# EAGLE schematic DDS Sine Sweeper (EAGLE 6.4)
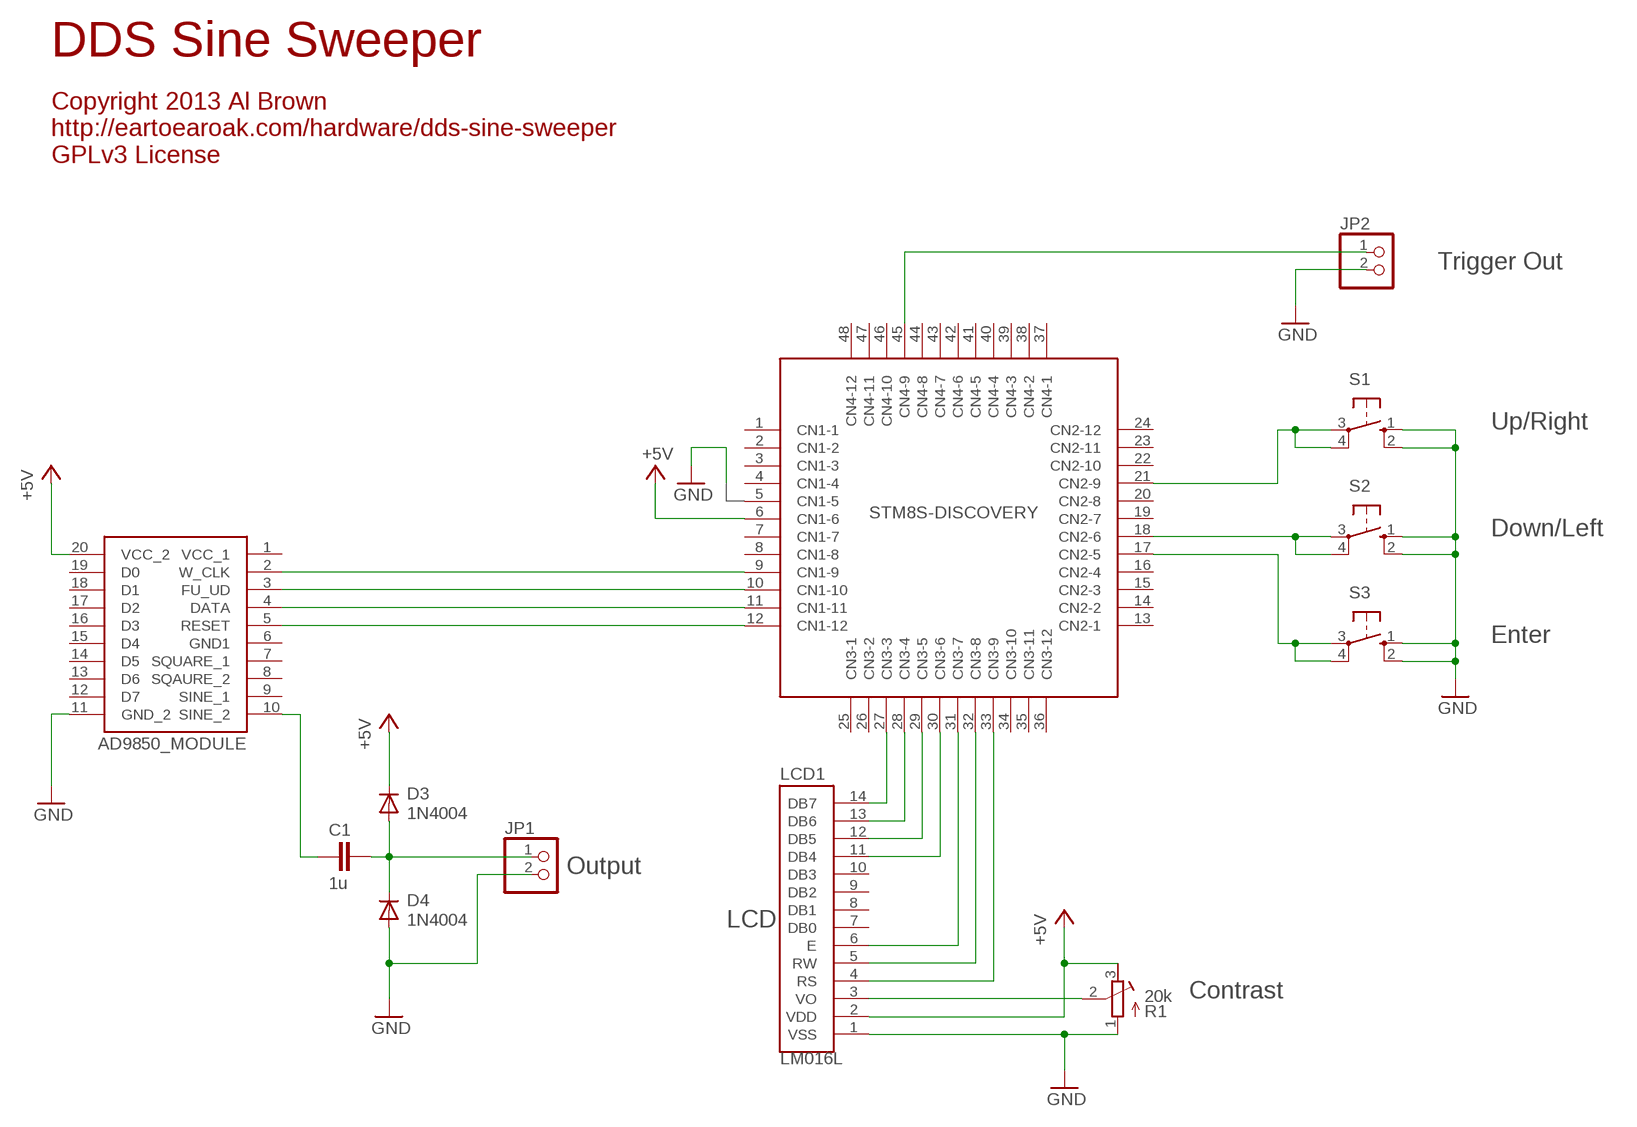
[diagram p0: schematic, sheet 1]

## Parts
BOARD1  STM8S-DISCOVERY  [STM8S-DISCOVERY]
BOARD2  AD9850_MODULE  [10X2]
C1  1u  C-EUC025_050-024X070  [C025_050-024X070]
D3  1N4004  [DO41-10]
D4  1N4004  [DO41-10]
JP1  PINHD-1X2  [1X02]
JP2  PINHD-1X2  [1X02]
LCD1  LM016L  [LM016L]
R1  20k  R-TRIMM3339P  [RTRIM3339P]
S1  10-XX  [B3F-10XX]
S2  10-XX  [B3F-10XX]
S3  10-XX  [B3F-10XX]

## Nets
+5V: BOARD1.6(CN1-6) BOARD2.20(VCC_2) D3.C LCD1.2(VDD) R1.3(A)
GND: BOARD2.11(GND_2) D4.A JP1.2 JP2.2 LCD1.1(VSS) R1.1(E) S1.1(S) S1.2(S1) S2.1(S) S2.2(S1) S3.1(S) S3.2(S1)
N$1: BOARD1.33(CN3-9) LCD1.4(RS)
N$2: BOARD1.32(CN3-8) LCD1.5(RW)
N$3: BOARD1.31(CN3-7) LCD1.6(E)
N$4: BOARD1.30(CN3-6) LCD1.11(DB4)
N$5: BOARD1.29(CN3-5) LCD1.12(DB5)
N$6: BOARD1.28(CN3-4) LCD1.13(DB6)
N$7: BOARD1.27(CN3-3) LCD1.14(DB7)
N$8: LCD1.3(VO) R1.2(S)
N$9: BOARD1.17(CN2-5) S3.3(P) S3.4(P1)
N$10: BOARD1.18(CN2-6) S2.3(P) S2.4(P1)
N$11: BOARD1.21(CN2-9) S1.3(P) S1.4(P1)
N$12: BOARD1.9(CN1-9) BOARD2.2(W_CLK)
N$13: BOARD1.10(CN1-10) BOARD2.3(FU_UD)
N$14: BOARD1.11(CN1-11) BOARD2.4(DATA)
N$15: BOARD1.12(CN1-12) BOARD2.5(RESET)
N$16: C1.2 D3.A D4.C JP1.1
N$17: BOARD2.10(SINE_2) C1.1
N$18: BOARD1.45(CN4-9) JP2.1
Unconnected: BOARD1.1(CN1-1) BOARD1.2(CN1-2) BOARD1.3(CN1-3) BOARD1.4(CN1-4) BOARD1.5(CN1-5) BOARD1.7(CN1-7) BOARD1.8(CN1-8) BOARD1.13(CN2-1) BOARD1.14(CN2-2) BOARD1.15(CN2-3) BOARD1.16(CN2-4) BOARD1.19(CN2-7) BOARD1.20(CN2-8) BOARD1.22(CN2-10) BOARD1.23(CN2-11) BOARD1.24(CN2-12) BOARD1.25(CN3-1) BOARD1.26(CN3-2) BOARD1.34(CN3-10) BOARD1.35(CN3-11) BOARD1.36(CN3-12) BOARD1.37(CN4-1) BOARD1.38(CN4-2) BOARD1.39(CN4-3) BOARD1.40(CN4-4) BOARD1.41(CN4-5) BOARD1.42(CN4-6) BOARD1.43(CN4-7) BOARD1.44(CN4-8) BOARD1.46(CN4-10) BOARD1.47(CN4-11) BOARD1.48(CN4-12) BOARD2.1(VCC_1) BOARD2.6(GND1) BOARD2.7(SQUARE_1) BOARD2.8(SQAURE_2) BOARD2.9(SINE_1) BOARD2.12(D7) BOARD2.13(D6) BOARD2.14(D5) BOARD2.15(D4) BOARD2.16(D3) BOARD2.17(D2) BOARD2.18(D1) BOARD2.19(D0) LCD1.7(DB0) LCD1.8(DB1) LCD1.9(DB2) LCD1.10(DB3)

## Notes on the sheet
- DDS Sine Sweeper
- Copyright 2013 Al Brown
  http://eartoearoak.com/hardware/dds-sine-sweeper
  GPLv3 License
- Trigger Out
- Up/Right
- Down/Left
- Enter
- Output
- LCD
- Contrast

## Library data of the parts
BOARD1 = STM8S-Discovery:STM8S-DISCOVERY: STM8S Discovery
BOARD2 = AS9850_Module:AD9850_MODULE
C1 = resistor:C-EU: CAPACITOR, European symbol
D3 D4 = diode:1N4004: DIODE general purpose rectifier, 1 A
JP1 JP2 = pinhead:PINHD-1X2: PIN HEADER
LCD1 = HD44870_Module:LM016L
R1 = resistor:R-TRIMM: Trimm resistor
S1-S3 = switch-omron:10-XX: OMRON SWITCH; MPN: B3F-1000; OC_FARNELL: 176432; OC_NEWARK: 36M3542